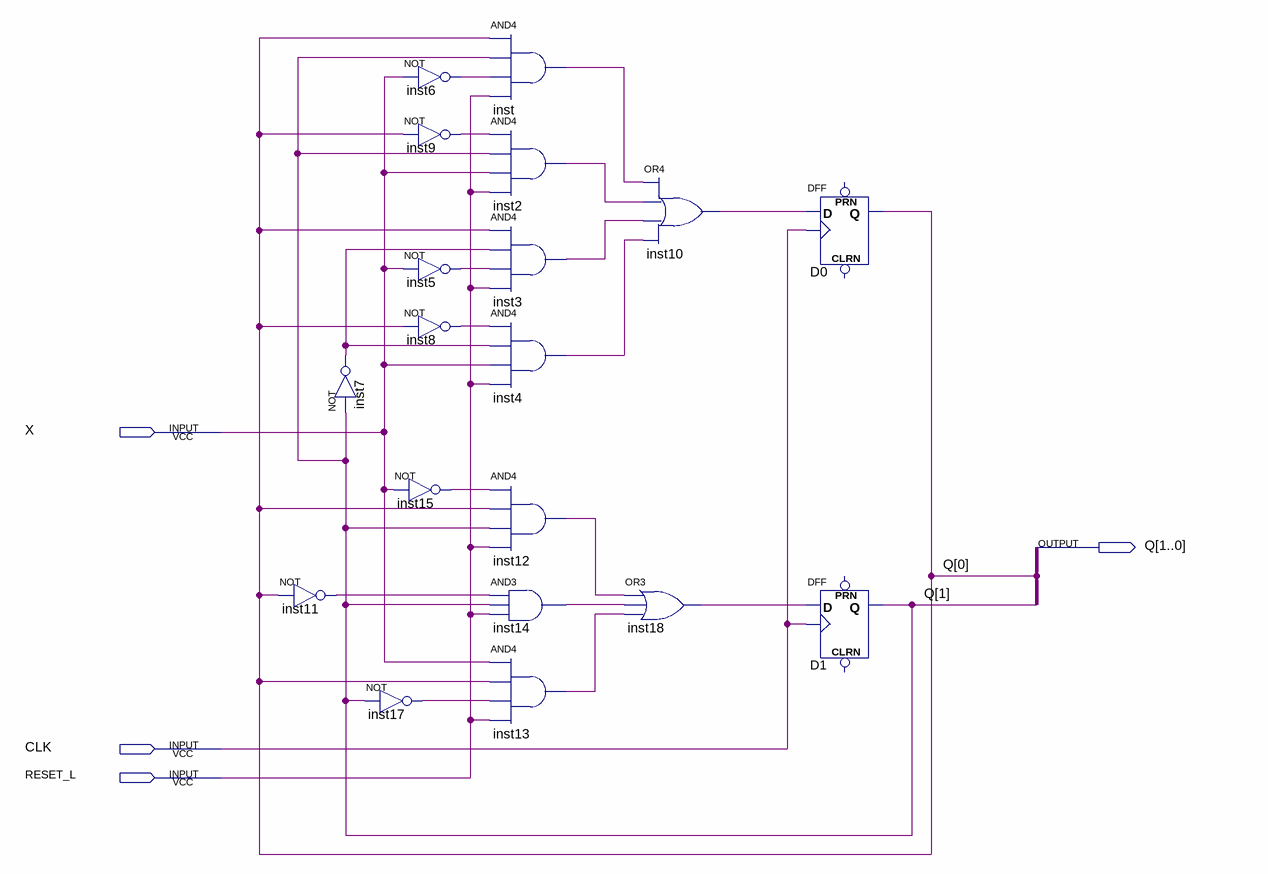
[diagram p0: schematic sheet]
// Quartus schematic MEF.bdf as structural Verilog: 19 symbols, 4 pins
module MEF (
  input  X,
  input  CLK,
  input  RESET_L,
  output [1:0] Q
);

  wire inst2_out, inst3_out, inst4_out, inst5_out, inst6_out, inst7_out, inst8_out, inst9_out, inst10_out,
       inst11_out, inst12_out, inst13_out, inst14_out, inst15_out, inst17_out, inst18_out, inst_out;

  not inst11 (inst11_out, Q[0]);
  not inst7 (inst7_out, Q[1]);
  not inst17 (inst17_out, Q[1]);
  not inst6 (inst6_out, X);
  not inst9 (inst9_out, Q[0]);
  not inst5 (inst5_out, X);
  not inst8 (inst8_out, Q[0]);
  not inst15 (inst15_out, X);
  and inst (inst_out, Q[0], Q[1], inst6_out, RESET_L);
  and inst2 (inst2_out, inst9_out, Q[1], X, RESET_L);
  and inst3 (inst3_out, Q[0], inst7_out, inst5_out, RESET_L);
  and inst4 (inst4_out, inst8_out, inst7_out, X, RESET_L);
  and inst12 (inst12_out, inst15_out, Q[0], Q[1], RESET_L);
  and inst14 (inst14_out, inst11_out, Q[1], RESET_L);
  and inst13 (inst13_out, X, Q[0], inst17_out, RESET_L);
  or inst10 (inst10_out, inst_out, inst2_out, inst3_out, inst4_out);
  or inst18 (inst18_out, inst12_out, inst14_out, inst13_out);
  DFF D0 (.CLK(CLK), .D(inst10_out), .Q(Q[0]));  // open: CLRN, PRN
  DFF D1 (.CLK(CLK), .D(inst18_out), .Q(Q[1]));  // open: CLRN, PRN
endmodule
